# Altium project Lab3_prelab_semaine2.PrjPcb
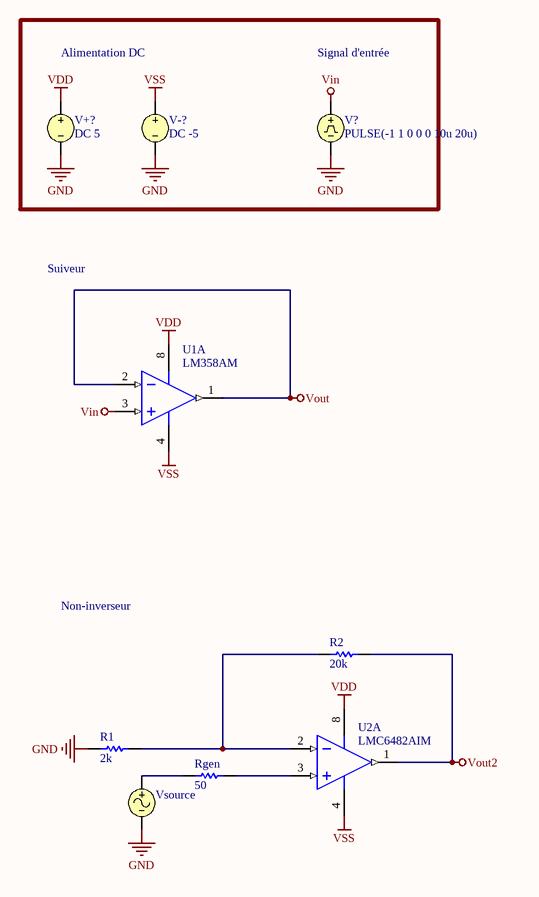
[diagram p0: Lab3_prelab_semaine2.SchDoc]
1 sheet, 9 parts. Net scope: global (net labels, ports and power ports of the same name join across sheets).

## Sheet Lab3_prelab_semaine2.SchDoc
size A4; SheetNumber: 1; SheetTotal: 1; SPICEModelCacheYOBGUQGC: <root> / <DocumentId>YOBGUQGC</DocumentId> / <CacheFrame Number="0"> / <Model Name="lm358" Kind="CKT"> / <Text>*////////////////////////////////////////////////////////// / *LM358 DUAL OPERATIONAL AMPLIFIER MACRO-MODEL / *////////////////////////////////////////////////////////// / * / * connections:      non-inverting input / *                   |   inverting input / *                   |   |   positive power supply / *                   |   |   |   negative power supply / *                   |   |   |   |   output / *                   |   |   |   |   | / *                   |   |   |   |   | / .SUBCKT LM358       1   2  99  50  28 / * / * PINOUT ORDER +IN -IN V+ V- OUT / * / * / *Features: / *Eliminates need for dual supplies / *Large DC voltage gain =             100dB / *High bandwidth =                     1MHz / *Low input offset voltage =            2mV / *Wide supply range =       +-1.5V to +-16V / * / *NOTE: Model is for single device only and simulated / *      supply current is 1/2 of total device current. / *      Output crossover distortion with dual supplies / *      is not modeled. / * / ****************INPUT STAGE************** / * / IOS 2 1 5N / *^Input offset current / R1 1 3 500K / R2 3 2 500K / I1 99 4 100U / R3 5 50 517 / R4 6 50 517 / Q1 5 2 4 QX / Q2 6 7 4 QX / *Fp2=1.2 MHz / C4 5 6 128.27P / * / ***********COMMON MODE EFFECT*********** / * / I2 99 50 75U / *^Quiescent supply current / EOS 7 1 POLY(1) 16 49 2E-3 1 / *Input offset voltage.^ / R8 99 49 60K / R9 49 50 60K / * / *********OUTPUT VOLTAGE LIMITING******** / V2 99 8 1.63 / D1 9 8 DX / D2 10 9 DX / V3 10 50 .635 / * / **************SECOND STAGE************** / * / EH 99 98 99 49 1 / G1 98 9 POLY(1) 5 6 0 9.8772E-4 0 .3459 / *Fp1=7.86 Hz / R5 98 9 101.2433MEG / C3 98 9 200P / * / ***************POLE STAGE*************** / * / *Fp=2 MHz / G3 98 15 9 49 1E-6 / R12 98 15 1MEG / C5 98 15 7.9577E-14 / * / *********COMMON-MODE ZERO STAGE********* / * / *Fpcm=10 KHz / G4 98 16 3 49 5.6234E-8 / L2 98 17 15.9M / R13 17 16 1K / * / **************OUTPUT STAGE************** / * / F6 50 99 POLY(1) V6 300U 1 / E1 99 23 99 15 1 / R16 24 23 17.5 / D5 26 24 DX / V6 26 22 .63V / R17 23 25 17.5 / D6 25 27 DX / V7 22 27 .63V / V5 22 21 0.27V / D4 21 15 DX / V4 20 22 0.27V / D3 15 20 DX / L3 22 28 500P / RL3 22 28 100K / * / ***************MODELS USED************** / * / .MODEL DX D(IS=1E-15) / .MODEL QX PNP(BF=1.111E3) / * / .ENDS</Text> / </Model> / <Model Name="lmc6482a" Kind="CKT"> / <Text>*////////////////////////////////////////////////////////// / *LMC6482A CMOS Dual OP-AMP MACRO-MODEL / *////////////////////////////////////////////////////////// / * / * connections:       non-inverting input / *                    |   inverting input / *                    |   |   positive power supply / *                    |   |   |   negative power supply / *                    |   |   |   |   output / *                    |   |   |   |   | / *                    |   |   |   |   | / .SUBCKT LMC6482A     1   2  99  50  40 / * / * PINOUT ORDER +IN -IN V+ V- OUT / * / * CAUTION:  SET .OPTIONS GMIN=1E-16 TO CORRECTLY MODEL INPUT BIAS CURRENT. / * / *Features: / *Operates from single or dual supplies / *Rail-to-rail input and output swing / *Ultra low input current =             10fA / *Slew rate =                        1.2V/uS / * / *NOTE: Model is for single device only and simulated / *      supply current is 1/2 of total device current. / *      Noise is not modeled. / *      Asymmetrical gain is not modeled. / * / *****************INPUT STAGE************** / * / I1  99  4 17U / M1   5  2 4 99 MOSFET / R3   5 50 5.651K / M2   6  7 4 99 MOSFET / R4   6 50 5.651K / *Fp2=5.9 MHz / C4   5  6 2.3868P / G0  98  9 6 5 4.4165E-2 / R0  98  9 1K / DP1  1 99 DA / DP2 50  1 DB / DP3  2 99 DB / DP4 50  2 DA / *For accurate Ib , set GMIN&lt;=1E-16 on .OPTIONS line. / * / ***********COMMON MODE EFFECT*********** / * / I2  99 50 420.5U / *^Quiescent current / EOS  7  1 POLY(1) 16 49 .75E-3 1 / *Offset voltage..........^ / R8  99 49 40K / R9  49 50 40K / * / ***************POLE STAGE*************** / * / *Fp=13.3 MHz / G3  98 15 9 49 1E-3 / R12 98 15 1K / C5  98 15 11.967P / * / ************POLE/ZERO STAGE************* / * / *Fp=600 KHz, Fz= 1.4MHz / G5  98 18 15 49 1E-3 / R14 98 18 1K / R15 98 19 750 / C6  19 18 151.58P / * / *********COMMON-MODE ZERO STAGE********* / * / *Fpcm=20 KHz / G4  98 16 POLY(2) 1 49 2 49 0 2.812E-8 2.812E-8 / L2  98 17 7.958M / R13 17 16 1K / * / **************SECOND STAGE************** / * / EH  99 98 99 49 1 / G1  98 29 18 49 5.6667E-6 / R5  98 29 100.37MEG / V2  99  8 1.56 / D1  29  8 DX / D2  10 29 DX / V3  10 50 1.56 / * / **************OUTPUT STAGE************** / * / F6  99 50 VA7 1 / *^Dynamic supply current / F5  99 35 VA8 1 / D3  36 35 DX / VA7 99 36 0 / D4  35 99 DX / E1  99 37 99 49 1 / VA8 37 38 0 / G6  38 40 49 29 16.667E-3 / R16 38 40 2.3886K / V4  30 40 .77 / D5  30 99 DX / V5  40 31 .77 / D6  50 31 DX / *Fp1=2.343 Hz / C3  29 39 17P / R6  39 40 1K / * / ***************MODELS USED************** / * / .MODEL DA D(IS=2E-14) / .MODEL DB D(IS=1E-14) / .MODEL DX D(IS=1E-14) / .MODEL MOSFET PMOS(VTO=0 KP=1.842E-3) / .ENDS</Text> / </Model> / </CacheFrame> / </root>

### Parts
R1  value 2k  (hidden comment: Resistor)
R2  value 20k  (hidden comment: Resistor)
Rgen  value 50  (hidden comment: Resistor)
U1  LM358AM  [M08A_N]  (part A of 2)
U2  LMC6482AIM  [M08A_N]  (part A of 2)
V+?  DC 5
V-?  DC -5
V?  PULSE(-1 1 0 0 0 10u 20u)
Vsource  SIN(0 Vx 10k 0 0 0)  (value not drawn)

### Nets
GND: R1.1 V+?.2 V-?.2 V?.2 Vsource.2
VDD: U1.8(V+) U2.8(V+) V+?.1
Vin: U1.3(INA+) V?.1
Vout: U1.1(OUTA) U1.2(INA-)
Vout2: R2.2 U2.1(OUTA)
VSS: U1.4(GND) U2.4(V-) V-?.1
NetR1_2: R1.2 R2.1 U2.2(INA-)
NetRgen_1: Rgen.1 Vsource.1
NetRgen_2: Rgen.2 U2.3(INA+)

### Notes on the sheet
- Alimentation DC
- Signal d'entrée
- Suiveur
- Non-inverseur

### Library data of the parts
R1 R2 Rgen = Resistor: TC1: 0; SimulationGenericComponent: True; TC2: 0
U1 = LM358AM: Low Power Dual Operational Amplifier; Manufacturer: National Semiconductor; CompType: Amplifiers; PackageTopMarking: NSZXTT*LM*358AM; PowerWise: N; Published: 4-Dec-2008; LatestRevisionDate: 13-Jan-2009; LatestRevisionNote: Sim Model Added.; DatasheetVersion: Oct-2005; PackageVersion: revL, Sep-2006; PackageReference: M08A; Publisher: Altium Limited; PackageDescription: SOIC Narrow, 4.9 x 3.9 x 1.45mm, 8 Lead, 1.27mm Pitch; PartNumber: LM358AM; RoHS: O; PinCount: 8; DigiKeyPartNumber: LM358AMXCT-ND; Code_JEDEC: MS-012-AA; Code_IPC: SOIC127P600-8; ComponentLink1Description: LM358 Datasheet; ComponentLink1URL: http://www.national.com/ds/LM/LM358.pdf; ComponentLink2Description: LM358 Web Page; ComponentLink2URL: http://www.national.com/pf/LM/LM358.html; ComponentLink3Description: M08A Package Page; ComponentLink3URL: http://www.national.com/packaging/folders/m08a.html
U2 = LMC6482AIM: CMOS Dual Rail-to-Rail Input and Output Operational Amplifier, 8-pin Narrow SOIC; Manufacturer: National Semiconductor; PackageTopMarking: NSZXTT*LMC64*82AIM; PowerWise: N; CompType: Amplifiers; Published: 4-Dec-2008; LatestRevisionDate: 13-Jan-2009; LatestRevisionNote: Sim Model Added.; DatasheetVersion: Sep-2003; PackageVersion: revM, May-2009; PackageReference: M08A; Publisher: Altium Limited; PackageDescription: SOIC Narrow, 4.9 x 3.9 x 1.45mm, 8 Lead, 1.27mm Pitch; Supplier 1: Farnell; Supplier Part Number 1: 9494723; PartNumber: LMC6482AIM; RoHS: N; PinCount: 8; Code_JEDEC: MS-012-AA; Code_IPC: SOIC127P600-8; ComponentLink1Description: LMC6482 Datasheet; ComponentLink1URL: http://www.national.com/ds/LM/LMC6482.pdf; ComponentLink2Description: LMC6482 Web Page; ComponentLink2URL: http://www.national.com/pf/LM/LMC6482.html; ComponentLink3Description: M08A Package Page; ComponentLink3URL: http://www.national.com/packaging/folders/m08a.html
V+? = VSRC: Voltage Source; Note: PCB Footprint - Not required; Value: 5; Published: 8-Jun-2000; LatestRevisionDate: 17-Jul-2002; LatestRevisionNote: Re-released for DXP Platform.; PackageReference: Not Applicable; Publisher: Altium Limited
V-? = VSRC: Voltage Source; Note: PCB Footprint - Not required; Published: 8-Jun-2000; LatestRevisionDate: 17-Jul-2002; LatestRevisionNote: Re-released for DXP Platform.; PackageReference: Not Applicable; Publisher: Altium Limited; Value: -5
V? = VPULSE: Pulse Voltage Source; Note: PCB Footprint - Not required; Pulsed Value: 1; Time Delay: 0; Published: 8-Jun-2000; LatestRevisionDate: 15-Nov-2004; LatestRevisionNote: Corrected Netlist.; PackageReference: Not Applicable; Publisher: Altium Limited; Initial Value: -1; Rise Time: 0; Fall Time: 0; Pulse Width: 10u; Period: 20u; DC Magnitude: 0; AC Magnitude: 1; AC Phase: 0
Vsource = VSIN: Sinusoidal Voltage Source; Note: PCB Footprint - Not required; Offset: 0; AC Magnitude: 1; Published: 8-Jun-2000; LatestRevisionDate: 15-Nov-2004; LatestRevisionNote: Corrected Netlist.; PackageReference: Not Applicable; Publisher: Altium Limited; Amplitude: Vx; Frequency: 10k; Delay: 0; Damping Factor: 0; Phase: 0; DC Magnitude: 0; AC Phase: 0